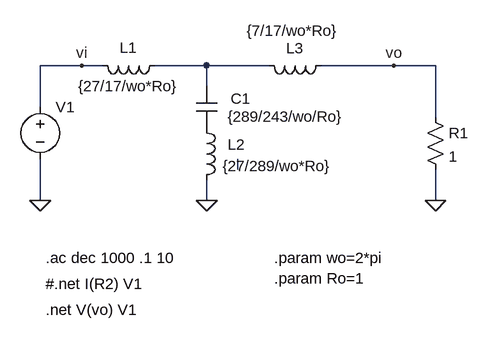
[diagram p0: schematic tee_simple_cargado.asc]
tee_simple_cargado.asc, the LTspice schematic file:
Version 4
SHEET 1 880 1328
WIRE 64 464 0 464
WIRE 96 464 64 464
WIRE 256 464 176 464
WIRE 352 464 256 464
WIRE 544 464 432 464
WIRE 608 464 544 464
WIRE 256 496 256 464
WIRE 0 528 0 464
WIRE 608 544 608 464
WIRE 304 624 304 608
WIRE 0 672 0 608
WIRE 256 672 256 640
WIRE 608 672 608 624
FLAG 0 672 0
FLAG 64 464 vi
FLAG 544 464 vo
FLAG 256 672 0
FLAG 608 672 0
SYMBOL voltage 0 512 R0
WINDOW 3 24 96 Invisible 2
SYMATTR Value 0
SYMATTR InstName V1
SYMATTR Value2 AC 1 0
SYMATTR SpiceLine Rser=0
SYMBOL ind 192 448 R90
WINDOW 0 4 56 VBottom 2
WINDOW 3 32 56 VTop 2
SYMATTR InstName L1
SYMATTR Value {27/17/wo*Ro}
SYMATTR SpiceLine Rser=0
SYMBOL ind 240 544 R0
WINDOW 0 48 42 Left 2
WINDOW 3 41 75 Left 2
SYMATTR InstName L2
SYMATTR Value {27/289/wo*Ro}
SYMATTR SpiceLine Rser=0
SYMBOL cap 240 496 R0
WINDOW 0 53 19 Left 2
WINDOW 3 48 47 Left 2
SYMATTR InstName C1
SYMATTR Value {289/243/wo/Ro}
SYMBOL ind 448 448 R90
WINDOW 0 5 56 VBottom 2
WINDOW 3 -53 60 VTop 2
SYMATTR InstName L3
SYMATTR Value {7/17/wo*Ro}
SYMATTR SpiceLine Rser=0
SYMBOL res 592 528 R0
SYMATTR InstName R1
SYMATTR Value 1
TEXT 8 800 Left 2 !#.net I(R2) V1
TEXT 8 760 Left 2 !.ac dec 1000 .1 10
TEXT 360 760 Left 2 !.param wo=2*pi
TEXT 360 792 Left 2 !.param Ro=1
TEXT 8 840 Left 2 !.net V(vo) V1

The netlist it stands for:
* tee_simple_cargado.asc
V1 vi 0 0 AC 1 0 Rser=0
L1 N001 vi {27/17/wo*Ro} Rser=0
L2 P001 0 {27/289/wo*Ro} Rser=0
C1 N001 P001 {289/243/wo/Ro}
L3 vo N001 {7/17/wo*Ro} Rser=0
R1 vo 0 1
#.net I(R2) V1
.ac dec 1000 .1 10
.param wo=2*pi
.param Ro=1
.net V(vo) V1
.backanno
.end

* Results of the author's LTspice run, read from the files saved beside the schematic
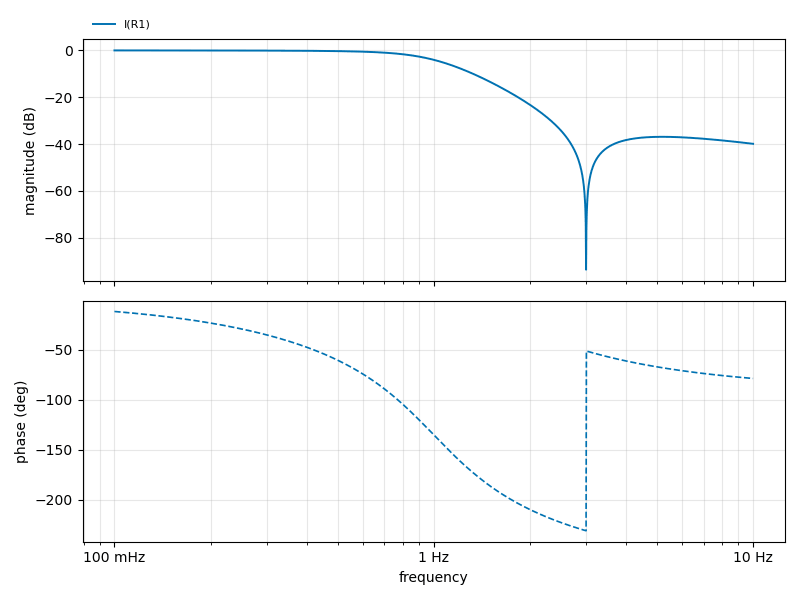
[diagram p1: AC Analysis of tee_simple_cargado.asc, plotted from the saved traces]
* AC Analysis, 1 run:
*   I(R1): -0.01 dB at 100 mHz, -39.90 dB at 10 Hz, peak -0.01 dB at 100 mHz, 3 dB below the peak at 928.1 mHz